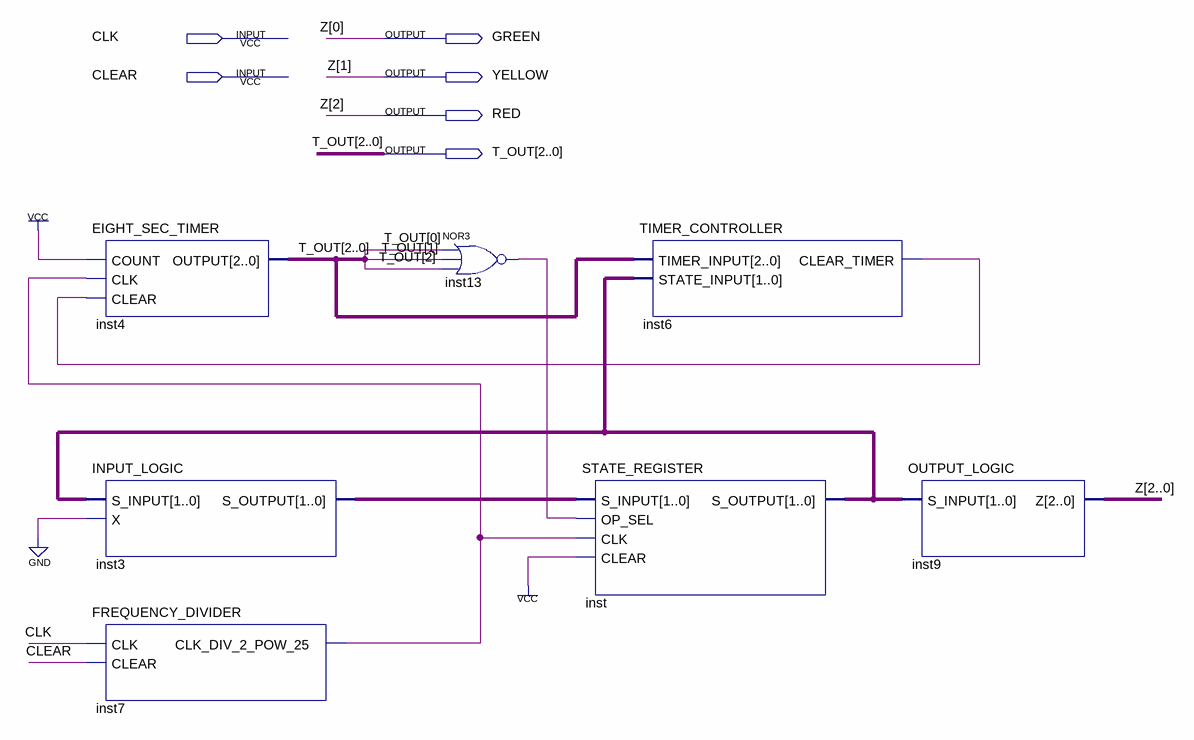
[diagram p0: schematic sheet]
// Quartus schematic SEMAFORO.bdf as structural Verilog: 7 symbols, 6 pins
module SEMAFORO (
  input  CLK,
  input  CLEAR,
  output GREEN,
  output YELLOW,
  output RED,
  output [2:0] T_OUT
);

  wire inst6_clear_timer, inst7_clk_div_2_pow_25, inst13_out;
  wire [1:0] inst3_s_output, inst_s_output;

  EIGHT_SEC_TIMER inst4 (.COUNT(1'b1), .CLK(inst7_clk_div_2_pow_25), .CLEAR(inst6_clear_timer), .OUTPUT(T_OUT));
  INPUT_LOGIC inst3 (.S_INPUT(inst_s_output), .X(1'b0), .S_OUTPUT(inst3_s_output));
  FREQUENCY_DIVIDER inst7 (.CLK(CLK), .CLEAR(CLEAR), .CLK_DIV_2_POW_25(inst7_clk_div_2_pow_25));
  nor inst13 (inst13_out, T_OUT[0], T_OUT[1], T_OUT[2]);
  STATE_REGISTER inst (
    .S_INPUT(inst3_s_output), .OP_SEL(inst13_out), .CLK(inst7_clk_div_2_pow_25), .CLEAR(1'b1),
    .S_OUTPUT(inst_s_output));
  TIMER_CONTROLLER inst6 (.TIMER_INPUT(T_OUT), .STATE_INPUT(inst_s_output), .CLEAR_TIMER(inst6_clear_timer));
  OUTPUT_LOGIC inst9 (.S_INPUT(inst_s_output), .Z({RED, YELLOW, GREEN}));

  // Other names for the same wires on the sheet: Z[2:0] = {RED, YELLOW, GREEN}
endmodule
